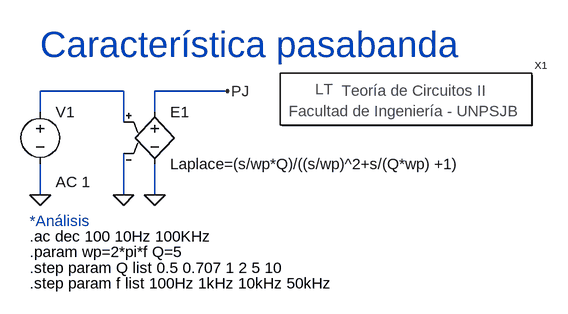
[diagram p0: schematic característicafiltropasabanda.asc]
característicafiltropasabanda.asc, the LTspice schematic file:
Version 4
SHEET 1 880 680
WIRE -128 80 -256 80
WIRE 32 80 -80 80
WIRE -256 112 -256 80
WIRE -80 112 -80 80
WIRE -128 128 -128 80
WIRE -256 240 -256 192
WIRE -128 240 -128 176
WIRE -80 240 -80 192
FLAG 32 80 PJ
FLAG -80 240 0
FLAG -128 240 0
FLAG -256 240 0
SYMBOL voltage -256 96 R0
WINDOW 123 24 124 Left 2
WINDOW 39 0 0 Left 0
SYMATTR InstName V1
SYMATTR Value ""
SYMATTR Value2 AC 1
SYMBOL e -80 96 R0
SYMATTR InstName E1
SYMATTR Value Laplace=(s/wp*Q)/((s/wp)^2+s/(Q*wp) +1)
SYMBOL Circuitos2\\Letreros\\Teoría\ de\ Circuitos\ II 304 96 R0
SYMATTR InstName X1
TEXT -272 280 Left 2 ;*Análisis
TEXT -272 304 Left 2 !.ac dec 100 10Hz 100KHz
TEXT -272 328 Left 2 !.param wp=2*pi*f Q=5
TEXT -272 352 Left 2 !.step param Q list 0.5 0.707 1 2 5 10
TEXT -272 376 Left 2 !.step param f list 100Hz 1kHz 10kHz 50kHz
TEXT -256 8 Left 5 ;Característica pasabanda

The netlist it stands for:
* característicafiltropasabanda.asc
V1 N001 0 AC 1
E1 PJ 0 N001 0 Laplace=(s/wp*Q)/((s/wp)^2+s/(Q*wp) +1)
XX1 Teoría de Circuitos II
* *Análisis
.ac dec 100 10Hz 100KHz
.param wp=2*pi*f Q=5
.step param Q list 0.5 0.707 1 2 5 10
.step param f list 100Hz 1kHz 10kHz 50kHz
* Característica pasabanda
.backanno
.end